# Altium schematic sheet WaterDepth.SchDoc
size A3
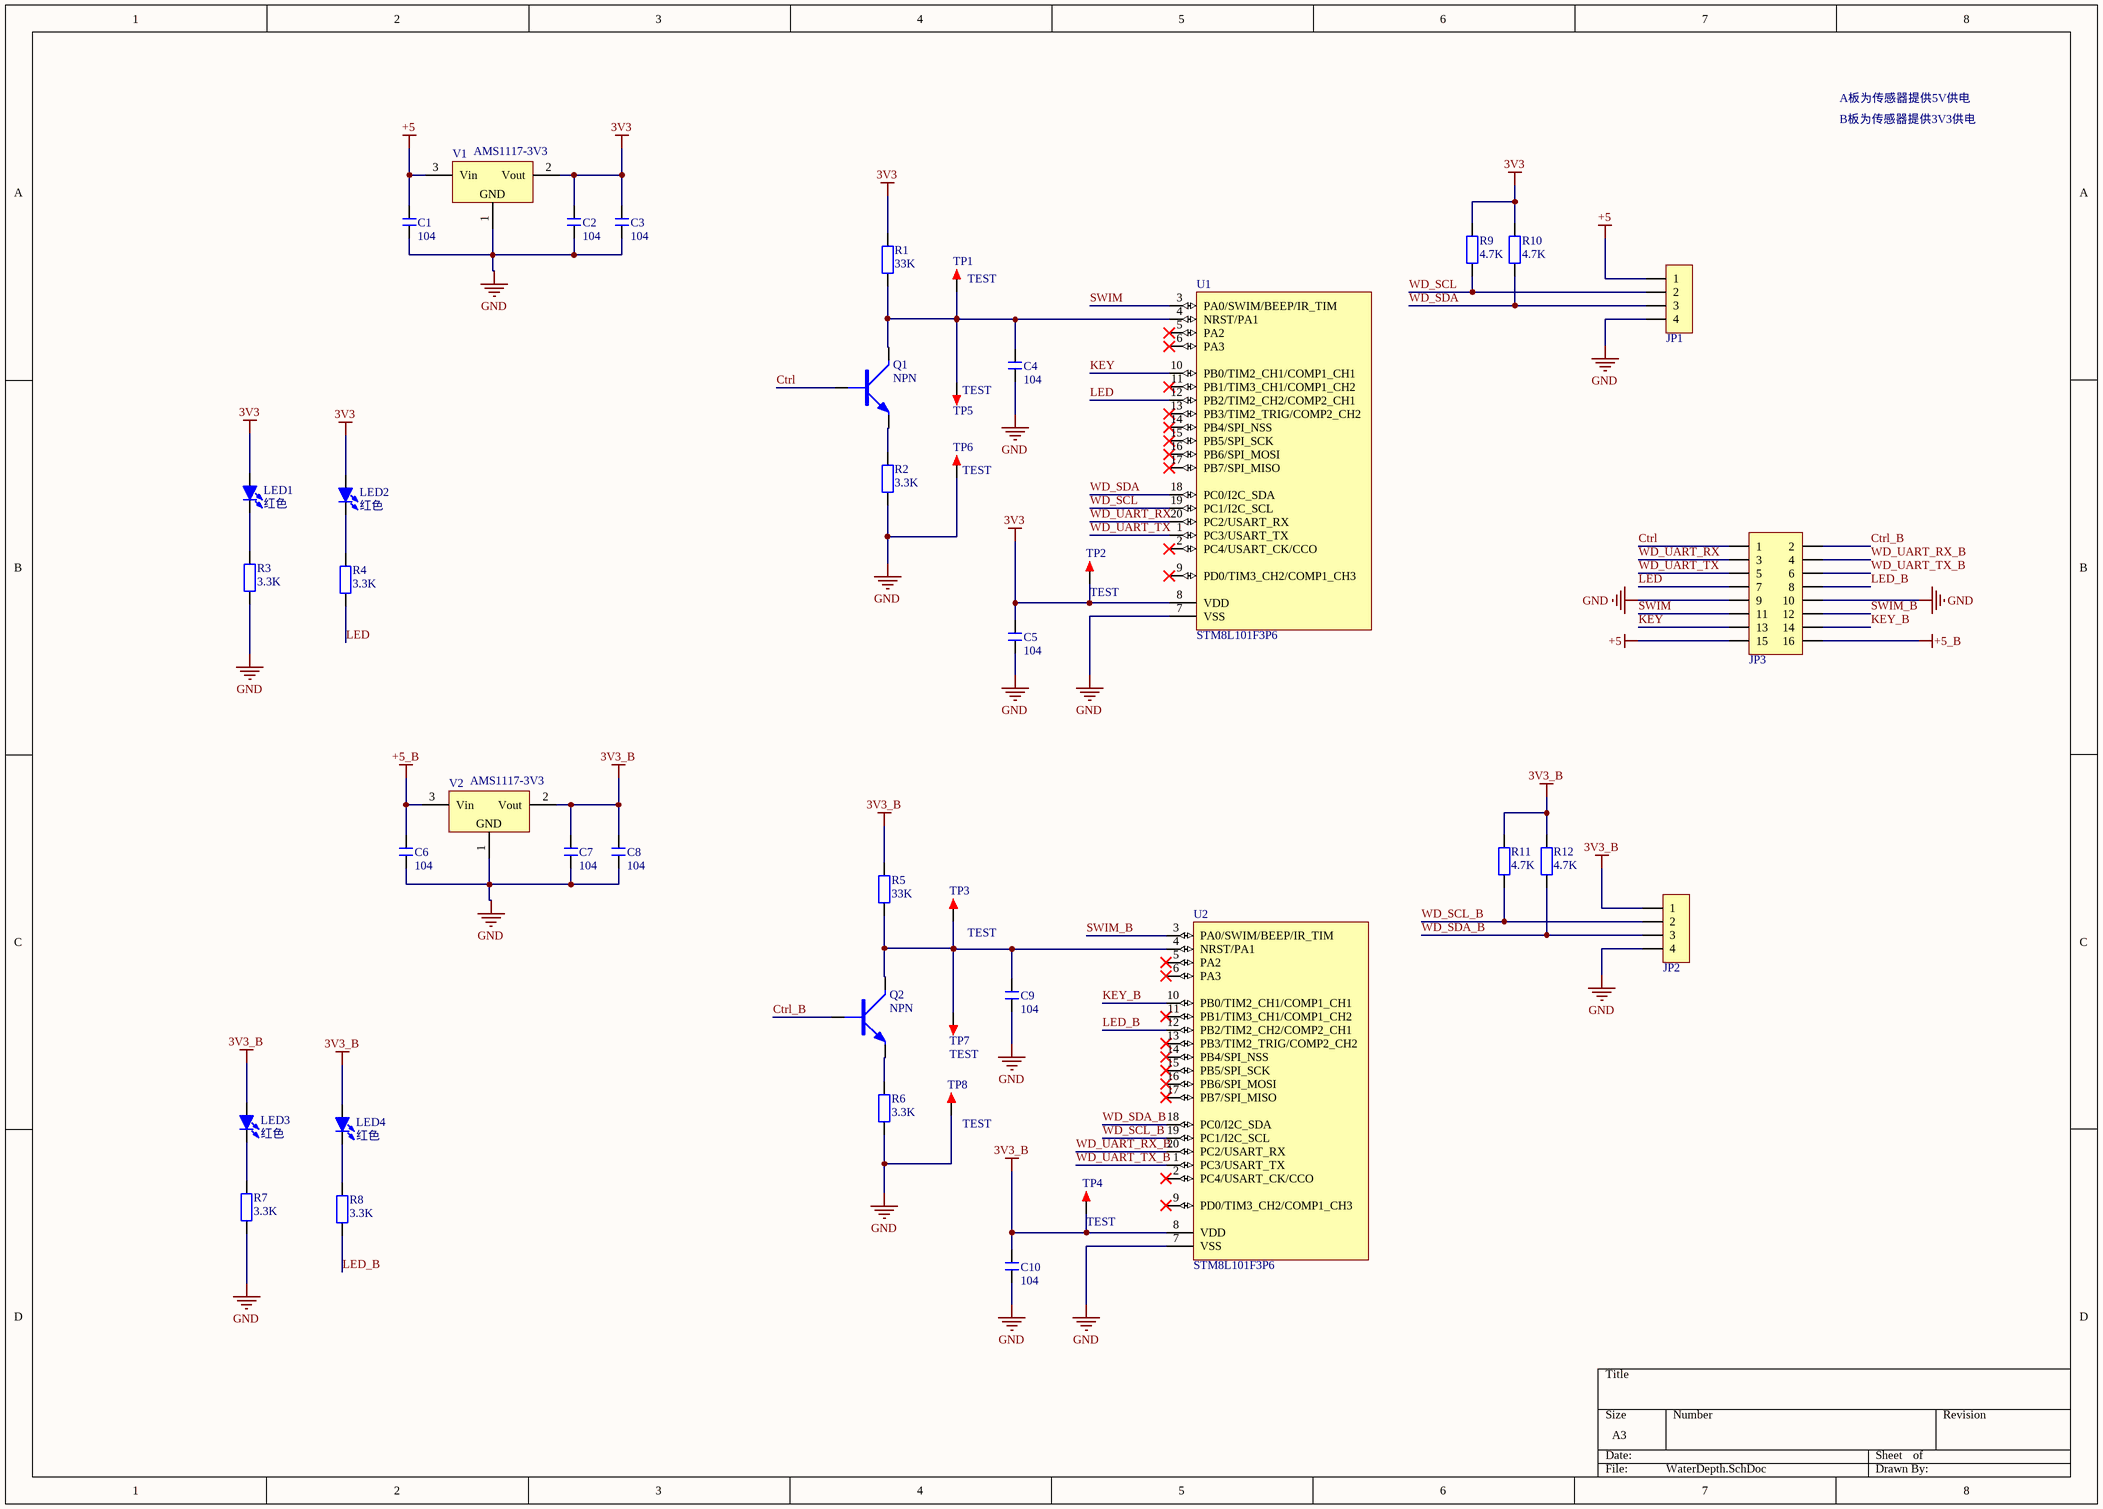
[diagram p0: WaterDepth.SchDoc]

## Parts
C1  104  [C 0603_L]
C2  104  [C 0603_L]
C3  104  [C 0603_L]
C4  104  [C 0603_L]
C5  104  [C 0603_L]
C6  104  [C 0603_L]
C7  104  [C 0603_L]
C8  104  [C 0603_L]
C9  104  [C 0603_L]
C10  104  [C 0603_L]
JP1  HDR-1X4  [MX 1.25-LS-4P]  (value not drawn)
JP2  HDR-1X4  [MX 1.25-LS-4P]  (value not drawn)
JP3  Header 8X2  [HDR2.54-LI-2x8P]  (value not drawn)
LED1  红色  [LED 0603W]
LED2  红色  [LED 0603W]
LED3  红色  [LED 0603W]
LED4  红色  [LED 0603W]
Q1  NPN  [SOT-23]
Q2  NPN  [SOT-23]
R1  33K  [R 0603_L]
R2  3.3K  [R 0603_L]
R3  3.3K  [R 0603_L]
R4  3.3K  [R 0603_L]
R5  33K  [R 0603_L]
R6  3.3K  [R 0603_L]
R7  3.3K  [R 0603_L]
R8  3.3K  [R 0603_L]
R9  4.7K  [R 0603_L]
R10  4.7K  [R 0603_L]
R11  4.7K  [R 0603_L]
R12  4.7K  [R 0603_L]
TP1  TEST  [TEST 1]
TP2  TEST  [TEST 1]
TP3  TEST  [TEST 1]
TP4  TEST  [TEST 1]
TP5  TEST  [TEST 1]
TP6  TEST  [TEST 1]
TP7  TEST  [TEST 1]
TP8  TEST  [TEST 1]
U1  STM8L101F3P6  [TSSOP-20]
U2  STM8L101F3P6  [TSSOP-20]
V1  AMS1117-3V3  [SOT89_N]
V2  AMS1117-3V3  [SOT89_N]

## Nets
3V3: C2.2 C3.2 C5.2 LED1.1(A) LED2.1(A) R1.2 R9.2 R10.2 TP2.1 U1.8(VDD) V1.2(Vout)
3V3_B: C7.2 C8.2 C10.2 JP2.1 LED3.1(A) LED4.1(A) R5.2 R11.2 R12.2 TP4.1 U2.8(VDD) V2.2(Vout)
+5: C1.2 JP1.1 JP3.15 V1.3(Vin)
+5_B: C6.2 JP3.16 V2.3(Vin)
GND: C1.1 C2.1 C3.1 C4.1 C5.1 C6.1 C7.1 C8.1 C9.1 C10.1 JP1.4 JP2.4 JP3.9 JP3.10 R2.1 R3.1 R6.1 R7.1 TP6.1 TP8.1 U1.7(VSS) U2.7(VSS) V1.1(GND) V2.1(GND)
Ctrl: JP3.1 Q1.B
Ctrl_B: JP3.2 Q2.B
KEY: JP3.13 U1.10(PB0/TIM2_CH1/COMP1_CH1)
KEY_B: JP3.14 U2.10(PB0/TIM2_CH1/COMP1_CH1)
LED: JP3.7 R4.1 U1.12(PB2/TIM2_CH2/COMP2_CH1)
LED_B: JP3.8 R8.1 U2.12(PB2/TIM2_CH2/COMP2_CH1)
SWIM: JP3.11 U1.3(PA0/SWIM/BEEP/IR_TIM)
SWIM_B: JP3.12 U2.3(PA0/SWIM/BEEP/IR_TIM)
WD_SCL: JP1.2 R9.1 U1.19(PC1/I2C_SCL)
WD_SCL_B: JP2.2 R11.1 U2.19(PC1/I2C_SCL)
WD_SDA: JP1.3 R10.1 U1.18(PC0/I2C_SDA)
WD_SDA_B: JP2.3 R12.1 U2.18(PC0/I2C_SDA)
WD_UART_RX: JP3.3 U1.20(PC2/USART_RX)
WD_UART_RX_B: JP3.4 U2.20(PC2/USART_RX)
WD_UART_TX: JP3.5 U1.1(PC3/USART_TX)
WD_UART_TX_B: JP3.6 U2.1(PC3/USART_TX)
NetC4_2: C4.2 Q1.C R1.1 TP1.1 TP5.1 U1.4(NRST/PA1)
NetC9_2: C9.2 Q2.C R5.1 TP3.1 TP7.1 U2.4(NRST/PA1)
NetLED1_2: LED1.2(K) R3.2
NetLED2_2: LED2.2(K) R4.2
NetLED3_2: LED3.2(K) R7.2
NetLED4_2: LED4.2(K) R8.2
NetQ1_E: Q1.E R2.2
NetQ2_E: Q2.E R6.2

Not connected (* = marked no-connect by the designer): U1 2(PC4/USART_CK/CCO)* 5(PA2)* 6(PA3)* 9(PD0/TIM3_CH2/COMP1_CH3)* 11(PB1/TIM3_CH1/COMP1_CH2)* 13(PB3/TIM2_TRIG/COMP2_CH2)* 14(PB4/SPI_NSS)* 15(PB5/SPI_SCK)* 16(PB6/SPI_MOSI)* 17(PB7/SPI_MISO)*; U2 2(PC4/USART_CK/CCO)* 5(PA2)* 6(PA3)* 9(PD0/TIM3_CH2/COMP1_CH3)* 11(PB1/TIM3_CH1/COMP1_CH2)* 13(PB3/TIM2_TRIG/COMP2_CH2)* 14(PB4/SPI_NSS)* 15(PB5/SPI_SCK)* 16(PB6/SPI_MOSI)* 17(PB7/SPI_MISO)*

## Notes on the sheet
- A板为传感器提供5V供电
- B板为传感器提供3V3供电

## Library data of the parts
C1-C10 = C: 无极性贴片电容; 版权归属: 源创客; BOM名称: 无极性贴片电容; 学习资源: www.ooocke.com
JP1 JP2 = Header 4: 4P接插件; 版权归属: 源创客; BOM名称: 4P接插件; 学习资源: www.ooocke.com
JP3 = Header 8X2: 8*2P接插件; 版权归属: 源创客; BOM名称: 8*2P接插件; 学习资源: www.ooocke.com
LED1-LED4 = LED-SMD: 贴片LED; 版权归属: 源创客; BOM名称: 贴片LED; 学习资源: www.ooocke.com
Q1 Q2 = NPN: NPN三极管
R1-R12 = R: 贴片电阻; 版权归属: 源创客; BOM名称: 贴片电阻; 学习资源: www.ooocke.com
TP1-TP8 = TEST: 测试点; 版权归属: 源创客; BOM名称: 测试点; 学习资源: www.ooocke.com
U1 U2 = STM8L101F3P6: MCU; ComponentLink1Description: 供应商链接; ComponentLink1URL: http://www.szlcsc.com/product/details_30799.html; Package: TSSOP-20; Supplier: LC; SuppliersPartNumber: C30044
V1 V2 = AMS1117: 三端稳压芯片; BOM名称: 稳压芯片; 版权归属: 源创客; 学习资源: www.ooocke.com